# Altium schematic sheet switch_blank.SchDoc
size Letter; SheetNumber: 8; SheetTotal: 9
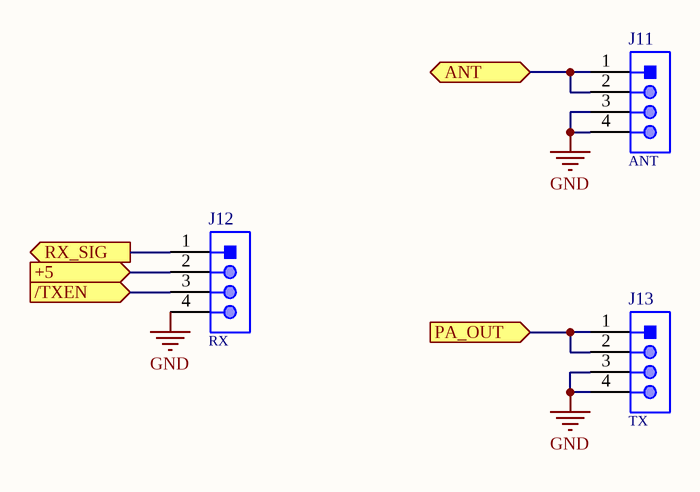
[diagram p0: switch_blank.SchDoc]

## Parts
J11  ANT  [61300411121]
J12  RX  [61300411121]
J13  TX  [61300411121]

## Ports
+5 (in), /TXEN (in), ANT (bidir), PA_OUT (in), RX_SIG (out)

## Nets
GND: J11.3 J11.4 J12.4 J13.3 J13.4
+5: J12.2 ; port +5
/TXEN: J12.3 ; port /TXEN
ANT: J11.1 J11.2 ; port ANT
PA_OUT: J13.1 J13.2 ; port PA_OUT
RX_SIG: J12.1 ; port RX_SIG

## Library data of the parts
J11-J13 = CMP-1502-01064-1: THT Vertical Pin Header WR-PHD, Pitch 2.54 mm, Single Row, 4 pins; Manufacturer: Wurth Elektronik; Withstanding Voltage: 500VAC; Rated Current: 3A; Working Voltage: 250VAC; Pin Number: 4; Gender: Male; Contact Resistance: 20mOhm; Pitch: 2.54mm; Manufacturer URL: http://www.we-online.de; Operating Temperature: -40to105degC; Packaging: Bag; Mounting Technology: THT; Package Reference: 61300411121; Datasheet URL: https://katalog.we-online.de/em/datasheet/6130xx11121.pdf; Publisher: WurthElektronik; Part Number: 61300411121; Row Number: Single; Orientation: Vertical